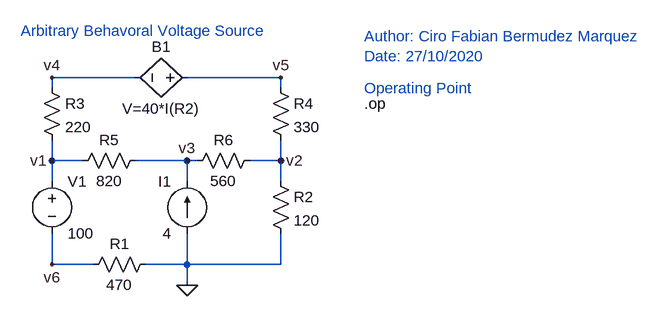
[diagram p0: schematic Super_mesh.asc]
Super_mesh.asc, the LTspice schematic file:
Version 4
SHEET 1 936 680
WIRE 128 -48 0 -48
WIRE 352 -48 208 -48
WIRE 0 -32 0 -48
WIRE 352 -32 352 -48
WIRE 0 80 0 48
WIRE 48 80 0 80
WIRE 208 80 128 80
WIRE 224 80 208 80
WIRE 352 80 352 48
WIRE 352 80 304 80
WIRE 0 112 0 80
WIRE 208 112 208 80
WIRE 352 112 352 80
WIRE 0 240 0 192
WIRE 64 240 0 240
WIRE 208 240 208 192
WIRE 208 240 144 240
WIRE 352 240 352 192
WIRE 352 240 208 240
WIRE 208 272 208 240
FLAG 208 272 0
FLAG 208 80 v3
FLAG 352 80 v2
FLAG 0 -48 v4
FLAG 352 -48 v5
FLAG 0 240 v6
FLAG 0 80 v1
SYMBOL voltage 0 96 R0
WINDOW 123 0 0 Left 0
WINDOW 39 0 0 Left 0
SYMATTR InstName V1
SYMATTR Value 100
SYMBOL res 160 224 R90
WINDOW 0 0 56 VBottom 2
WINDOW 3 32 56 VTop 2
SYMATTR InstName R1
SYMATTR Value 470
SYMBOL res 336 96 R0
SYMATTR InstName R2
SYMATTR Value 120
SYMBOL current 208 192 R180
WINDOW 0 24 80 Left 2
WINDOW 3 24 0 Left 2
WINDOW 123 0 0 Left 0
WINDOW 39 0 0 Left 0
SYMATTR InstName I1
SYMATTR Value 4
SYMBOL res -16 -48 R0
SYMATTR InstName R3
SYMATTR Value 220
SYMBOL res 336 -48 R0
SYMATTR InstName R4
SYMATTR Value 330
SYMBOL res 32 96 R270
WINDOW 0 32 56 VTop 2
WINDOW 3 0 56 VBottom 2
SYMATTR InstName R5
SYMATTR Value 820
SYMBOL res 208 96 R270
WINDOW 0 32 56 VTop 2
WINDOW 3 0 56 VBottom 2
SYMATTR InstName R6
SYMATTR Value 560
SYMBOL bv 224 -48 R90
WINDOW 0 -32 56 VBottom 2
WINDOW 3 32 56 VTop 2
SYMATTR InstName B1
SYMATTR Value V=40*I(R2)
TEXT 480 -8 Left 2 !.op
TEXT -48 -120 Left 2 ;Arbitrary Behavoral Voltage Source
TEXT 480 -112 Left 2 ;Author: Ciro Fabian Bermudez Marquez\nDate: 27/10/2020
TEXT 480 -32 Left 2 ;Operating Point

The netlist it stands for:
* Super_mesh.asc
V1 v1 v6 100
R1 0 v6 470
R2 v2 0 120
I1 0 v3 4
R3 v4 v1 220
R4 v5 v2 330
R5 v1 v3 820
R6 v3 v2 560
B1 v5 v4 V=40*I(R2)
.op
* Arbitrary Behavoral Voltage Source
* Author: Ciro Fabian Bermudez Marquez
* Date: 27/10/2020
* Operating Point
.backanno
.end